# Altium project Urukul.PrjPCB (part 7 of 11)

## Sheet Power_Supplies.SchDoc: =DocumentName
size A4; DocumentNumber: 1; Revision: 0; SheetNumber: 2; SheetTotal: 20; Version: 1.6; Author 1: Grzegorz Kasprowicz; Author 2: Filip Światkowski, Paweł Kulik, Maciej Przybysz; Author 3: Krzysztof Belewicz; Github: https://github.com/sinara-hw/Urukul; Last modified by: Krzysztof Belewicz
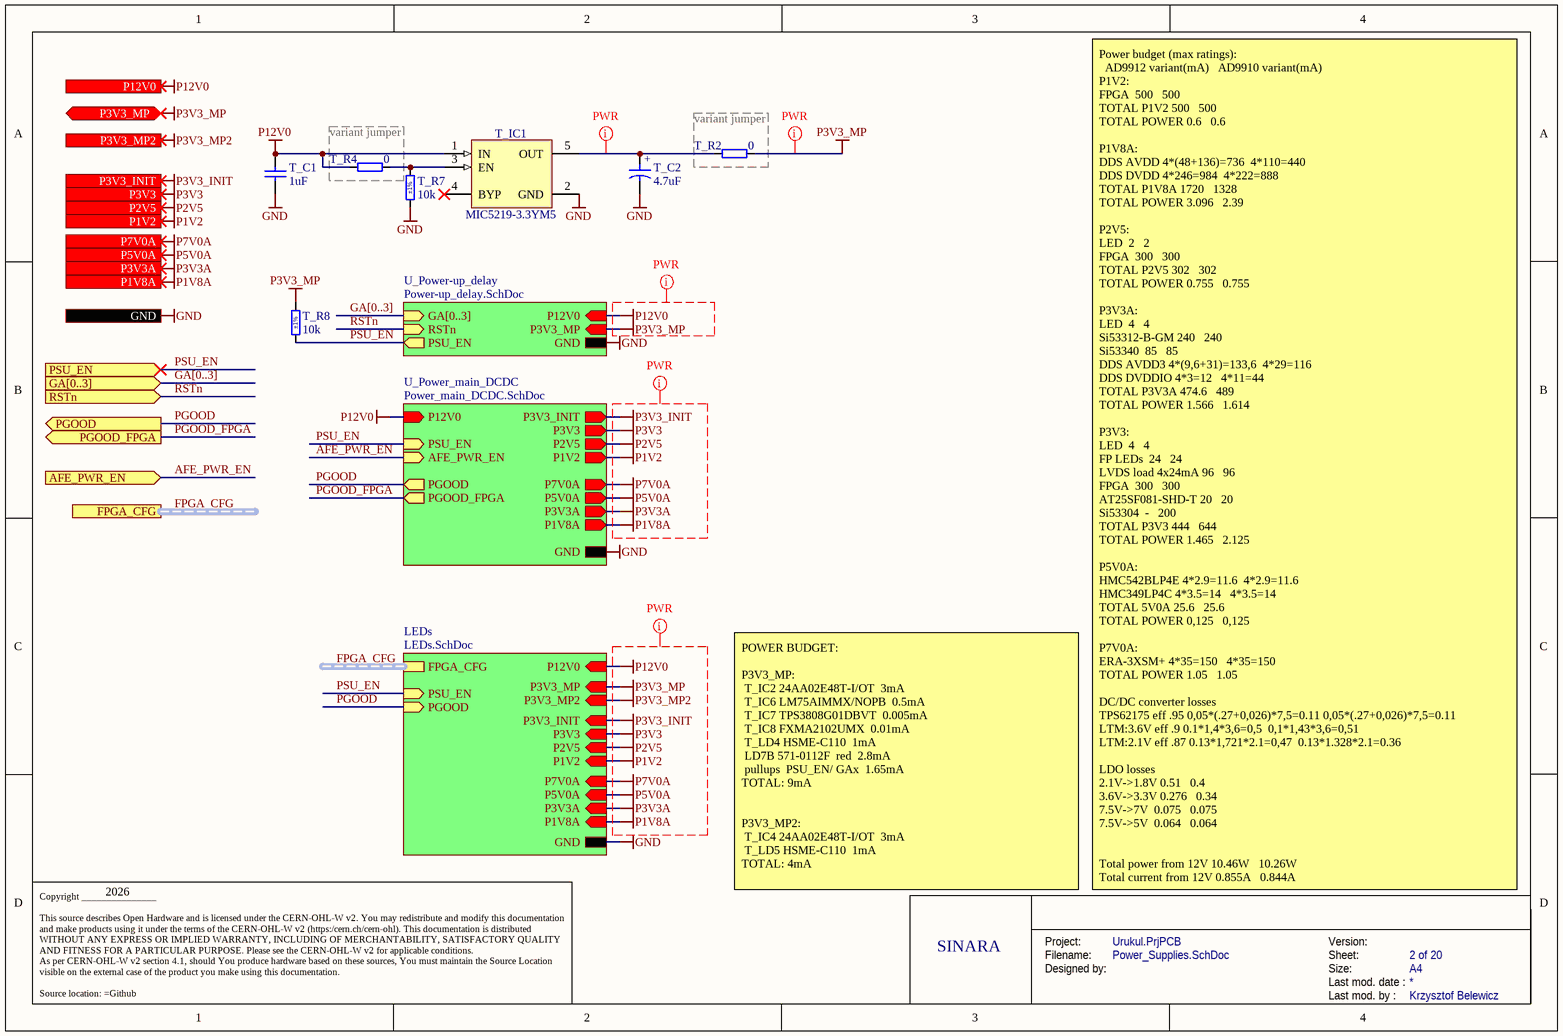
[diagram p16: Power_Supplies.SchDoc]

### Parts
T_C1  1uF  [CAPC1608X87N]
T_C2  4.7uF  [CAPMP3216X180N]
T_IC1  MIC5219-3.3YM5  [SOT95P280X145-5N]
T_R2  0  [RESC1005X40N]
T_R4  0  [RESC1005X40N]
T_R7  10k  Tolerance: ±1%  [RESC1005X40N]
T_R8  10k  Tolerance: ±1%  [RESC1005X40N]

### Blocks framed on the sheet
variant jumper: T_R4
variant jumper: T_R2

### Sub-sheets
LEDs = LEDs.SchDoc: PSU_EN (in), PGOOD (in), P3V3_MP2 (in), P12V0 (in), P3V3 (in), FPGA_CFG (harness FPGA_CFG), GND, P3V3_MP (in), P3V3_INIT (in), P2V5 (in), P1V2 (in), P7V0A (in), P5V0A (in), P3V3A (in), P1V8A (in)
U_Power-up_delay = Power-up_delay.SchDoc: GA[0..3] (in), RSTn (in), GND, PSU_EN (out), P3V3_MP (in), P12V0 (in)
U_Power_main_DCDC = Power_main_DCDC.SchDoc: P12V0 (in), GND, PSU_EN (in), PGOOD (out), P3V3 (out), P3V3_INIT (out), P2V5 (out), P1V2 (out), P3V3A (out), P1V8A (out), P5V0A (out), P7V0A (out), PGOOD_FPGA (out), AFE_PWR_EN (in)

### Ports
AFE_PWR_EN (in), FPGA_CFG (harness FPGA_CFG), GA[0..3] (in), GND, P1V2 (out), P1V8A (out), P2V5 (out), P3V3 (out), P3V3_INIT (out), P3V3_MP2 (in), P3V3_MP (bidir), P3V3A (out), P5V0A (out), P7V0A (out), P12V0 (in), PGOOD (out), PGOOD_FPGA (out), PSU_EN (in), RSTn (in)

### Nets
GND: T_C1.1 T_C2.2 T_IC1.2(GND) T_R7.1 ; port GND, sheet U_Power-up_delay/GND, sheet U_Power_main_DCDC/GND, sheet LEDs/GND
P1V2: port P1V2, sheet U_Power_main_DCDC/P1V2, sheet LEDs/P1V2
P1V8A: port P1V8A, sheet U_Power_main_DCDC/P1V8A, sheet LEDs/P1V8A
P2V5: port P2V5, sheet U_Power_main_DCDC/P2V5, sheet LEDs/P2V5
P3V3: port P3V3, sheet U_Power_main_DCDC/P3V3, sheet LEDs/P3V3
P3V3_INIT: port P3V3_INIT, sheet U_Power_main_DCDC/P3V3_INIT, sheet LEDs/P3V3_INIT
P3V3_MP: T_R2.2 T_R8.2 ; port P3V3_MP, sheet U_Power-up_delay/P3V3_MP, sheet LEDs/P3V3_MP
P3V3_MP2: port P3V3_MP2, sheet LEDs/P3V3_MP2
P3V3A: port P3V3A, sheet U_Power_main_DCDC/P3V3A, sheet LEDs/P3V3A
P5V0A: port P5V0A, sheet U_Power_main_DCDC/P5V0A, sheet LEDs/P5V0A
P7V0A: port P7V0A, sheet U_Power_main_DCDC/P7V0A, sheet LEDs/P7V0A
P12V0: T_C1.2 T_IC1.1(IN) T_R4.1 ; port P12V0, sheet U_Power-up_delay/P12V0, sheet U_Power_main_DCDC/P12V0, sheet LEDs/P12V0
AFE_PWR_EN: port AFE_PWR_EN, sheet U_Power_main_DCDC/AFE_PWR_EN
PGOOD: port PGOOD, sheet U_Power_main_DCDC/PGOOD, sheet LEDs/PGOOD  [project net INT_I2C_OE]
PGOOD_FPGA: port PGOOD_FPGA, sheet U_Power_main_DCDC/PGOOD_FPGA
PSU_EN: T_R8.1 ; port PSU_EN, sheet U_Power-up_delay/PSU_EN, sheet U_Power_main_DCDC/PSU_EN, sheet LEDs/PSU_EN
RSTn: port RSTn, sheet U_Power-up_delay/RSTn
NetT_C2_1: T_C2.1 T_IC1.5(OUT) T_R2.1
NetT_IC1_3: T_IC1.3(EN) T_R4.2 T_R7.2

Not connected (* = marked no-connect by the designer): T_IC1 4(BYP)*

### Buses and harness runs
bus GA[0..3] = port GA[0..3]
bus GA[0..3] = sheet U_Power-up_delay/GA[0..3]
harness FPGA_CFG = port FPGA_CFG
harness FPGA_CFG = sheet LEDs/FPGA_CFG

### Layout directives
net class PWR: NetT_C2_1, P1V2, P1V8A, P2V5, P3V3, P3V3_INIT, P3V3_MP, P3V3_MP2, P3V3A, P5V0A, P7V0A, P12V0

### Notes on the sheet
- 2026
- POWER BUDGET:
  P3V3_MP:
  T_IC2	24AA02E48T-I/OT		3mA
  T_IC6	LM75AIMMX/NOPB		0.5mA
  T_IC7	TPS3808G01DBVT		0.005mA
  T_IC8	FXMA2102UMX		0.01mA
  T_LD4	HSME-C110		1mA
  LD7B	571-0112F	 red		2.8mA
  pullups 	PSU_EN/ GAx		1.65mA
  TOTAL: 9mA
  P3V3_MP2:
  T_IC4	24AA02E48T-I/OT		3mA
  T_LD5	HSME-C110		1mA
  TOTAL: 4mA
- Power budget (max ratings):
  AD9912 variant(mA)	 	AD9910 variant(mA)
  P1V2:
  FPGA		500			500
  TOTAL P1V2	500			500
  TOTAL POWER	0.6			0.6
  P1V8A:
  DDS AVDD	4*(48+136)=736		4*110=440
  DDS DVDD	4*246=984		4*222=888
  TOTAL P1V8A	1720			1328
  TOTAL POWER	3.096			2.39
  P2V5:
  LED		2			2
  FPGA		300			300
  TOTAL P2V5	302			302
  TOTAL POWER	0.755			0.755
  P3V3A:
  LED		4			4
  Si53312-B-GM	240			240
  Si53340		85			85
  DDS AVDD3	4*(9,6+31)=133,6		4*29=116
  DDS DVDDIO	4*3=12			4*11=44
  TOTAL P3V3A	474.6			489
  TOTAL POWER	1.566			1.614
  P3V3:
  LED		4			4
  FP LEDs		24			24
  LVDS load 4x24mA	96			96
  FPGA		300			300
  AT25SF081-SHD-T	20			20
  Si53304		-			200
  TOTAL P3V3	444			644
  TOTAL POWER	1.465			2.125
  P5V0A:
  HMC542BLP4E	4*2.9=11.6		4*2.9=11.6
  HMC349LP4C	4*3.5=14			4*3.5=14
  TOTAL 5V0A	25.6			25.6
  TOTAL POWER	0,125			0,125
  P7V0A:
  ERA-3XSM+	4*35=150			4*35=150
  TOTAL POWER	1.05			1.05
  DC/DC converter losses
  TPS62175 eff .95	0,05*(.27+0,026)*7,5=0.11	0,05*(.27+0,026)*7,5=0.11
  LTM:3.6V eff .9	0.1*1,4*3,6=0,5		0,1*1,43*3,6=0,51
  LTM:2.1V eff .87	0.13*1,721*2.1=0,47		0.13*1.328*2.1=0.36
  LDO losses
  2.1V->1.8V	0.51			0.4
  3.6V->3.3V	0.276			0.34
  7.5V->7V		0.075			0.075
  7.5V->5V		0.064			0.064
  Total power from 12V 10.46W			10.26W
  Total current from 12V 0.855A			0.844A
- SINARA
- Project:
- Designed by:
- Filename:
- Size:
- Version:
- Last mod. date :
- Sheet:
- A4
- Copyright _______________
  This source describes Open Hardware and is licensed under the CERN-OHL-W v2. You may redistribute and modify this documentation and make products using it under the terms of the CERN-OHL-W v2 (https:/cern.ch/cern-ohl). This documentation is distributed WITHOUT ANY EXPRESS OR IMPLIED WARRANTY, INCLUDING OF MERCHANTABILITY, SATISFACTORY QUALITY AND FITNESS FOR A PARTICULAR PURPOSE. Please see the CERN-OHL-W v2 for applicable conditions.
  As per CERN-OHL-W v2 section 4.1, should You produce hardware based on these sources, You must maintain the Source Location visible on the external case of the product you make using this documentation.
  Source location: =Github
- Last mod. by :
- (in symbol CTE3216-18_4.7UF_10V_10%_AVX_TPSA475K010T1400) +

### Library data of the parts
T_C1 = CC0603_1UF_25V_10%_X7R: Non-polarised capacitor; Part Description: SMD Multilayer Chip Ceramic Capacitor; Manufacturer: GENERIC; Manufacturer1 Part Number: GRM188R71E105KA12D; Voltage: 25V; TC: X7R; Tolerance: ±10%; Part Number: CC0603_1UF_25V_10%_X7R; Component Kind: Standard; Component Type: Standard; Pin Count: 2; Value: 1uF; Status: None; Manufacturer Part Number: CC0603_1UF_25V_10%_X7R; Case: 0603; Mounted: Yes; Socket: No; SMD: Yes; Sense: No; Manufacturer1 Example: MURATA; Manufacturer1 ComponentHeight: 0.9mm; HelpURL: \\cern.ch\dfs\Applications\Altium\Datasheets\CC0603_X7R_MURATA.pdf; Author: CERN DEM JLC; CreateDate: 18.01.2011; LatestRevisionDate: 18.01.2011
T_C2 = CTE3216-18_4.7UF_10V_10%_AVX_TPSA475K010T1400: Polarised capacitor; Part Description: Low ESR 1R4 Automotive Solid Tantalum Chip Capacitor; Manufacturer: AVX; Voltage: 10V; Tolerance: ±10%; Part Number: CTE3216-18_4.7UF_10V_10%_AVX_TPSA475K010T1400; Component Kind: Standard; Component Type: Standard; Pin Count: 2; Value: 4.7uF; Status: Preferred; Manufacturer Part Number: TPSA475K010T1400; Case: A; Mounted: Yes; Socket: No; SMD: Yes; Sense: No; ComponentHeight: 1.8mm; HelpURL: \\cern.ch\dfs\Applications\Altium\Datasheets\CTE-LESR_AVX_TPS-AUTO.pdf; Author: CERN DEM JLC; CreateDate: 23.01.2018; LatestRevisionDate: 23.01.2018
T_IC1 = MIC5219-3.3YM5: 500mA Peak Output LDO Regulator; Part Description: 3.3V 500mA Peak Output Low Drop-Out  (LDO) Regulator; Manufacturer: MICROCHIP TECHNOLOGY; PressFit: No; Bonding: No; Part Number: MIC5219-3.3YM5; Component Kind: Standard; Component Type: Standard; Device: MIC5219-3.3YM5; PackageDescription: SOT, 0.95mm pitch; 5 pin, 1.60mm W X 2.90mm L X 1.45mm H body, IPC Medium Density; Manufacturer Part Number: MIC5219-3.3YM5; Pin Count: 5; Case: SOT23-5; Mounted: Yes; Socket: No; SMD: Yes; Sense: No; ComponentHeight: 1.45mm; HelpURL: \\cern.ch\dfs\Applications\Altium\Datasheets\MIC5219-3.3YM5.pdf; Author: CERN DEM WB; CreateDate: 2019-04-16; LatestRevisionDate: 2019-04-16
T_R2 T_R4 = R0402_0R_JUMPER: as T_R79-T_R83 on sheet Urukul_FPGA_Config; Part Number: R0402_0R_JUMPER; Component Kind: Standard; Component Type: Standard; Pin Count: 2; Value: 0; Status: Not Recommended; Manufacturer Part Number: R0402_0R_JUMPER; Case: 0402; Mounted: Yes; Sense: No; Socket: No; SMD: Yes; Manufacturer1 Example: YAGEO PHYCOMP; Manufacturer1 ComponentHeight: 0.4mm; HelpURL: \\cern.ch\dfs\Applications\Altium\Datasheets\R0402_Phycomp_RC0402.pdf; Author: CERN DEM JLC; CreateDate: 03.12.2007; LatestRevisionDate: 17.10.2012
T_R7 T_R8 = R0402_10K_1%_0.0625W_100PPM: as T_R70 on sheet Urukul_FPGA; Part Number: R0402_10K_1%_0.0625W_100PPM; Component Kind: Standard; Component Type: Standard; Pin Count: 2; Value: 10k; Status: Not Recommended; Power: 0.0625W; Manufacturer Part Number: R0402_10K_1%_0.0625W_100PPM; Case: 0402; Mounted: Yes; Sense: No; Socket: No; SMD: Yes; Manufacturer1 Example: YAGEO PHYCOMP; Manufacturer1 ComponentHeight: 0.4mm; HelpURL: \\cern.ch\dfs\Applications\Altium\Datasheets\R0402_Phycomp_RC0402.pdf; Author: CERN DEM JLC; CreateDate: 03.12.2007; LatestRevisionDate: 17.10.2012